# Altium schematic sheet Sheet5.SchDoc
size A3; SheetNumber: 1; SheetTotal: 1
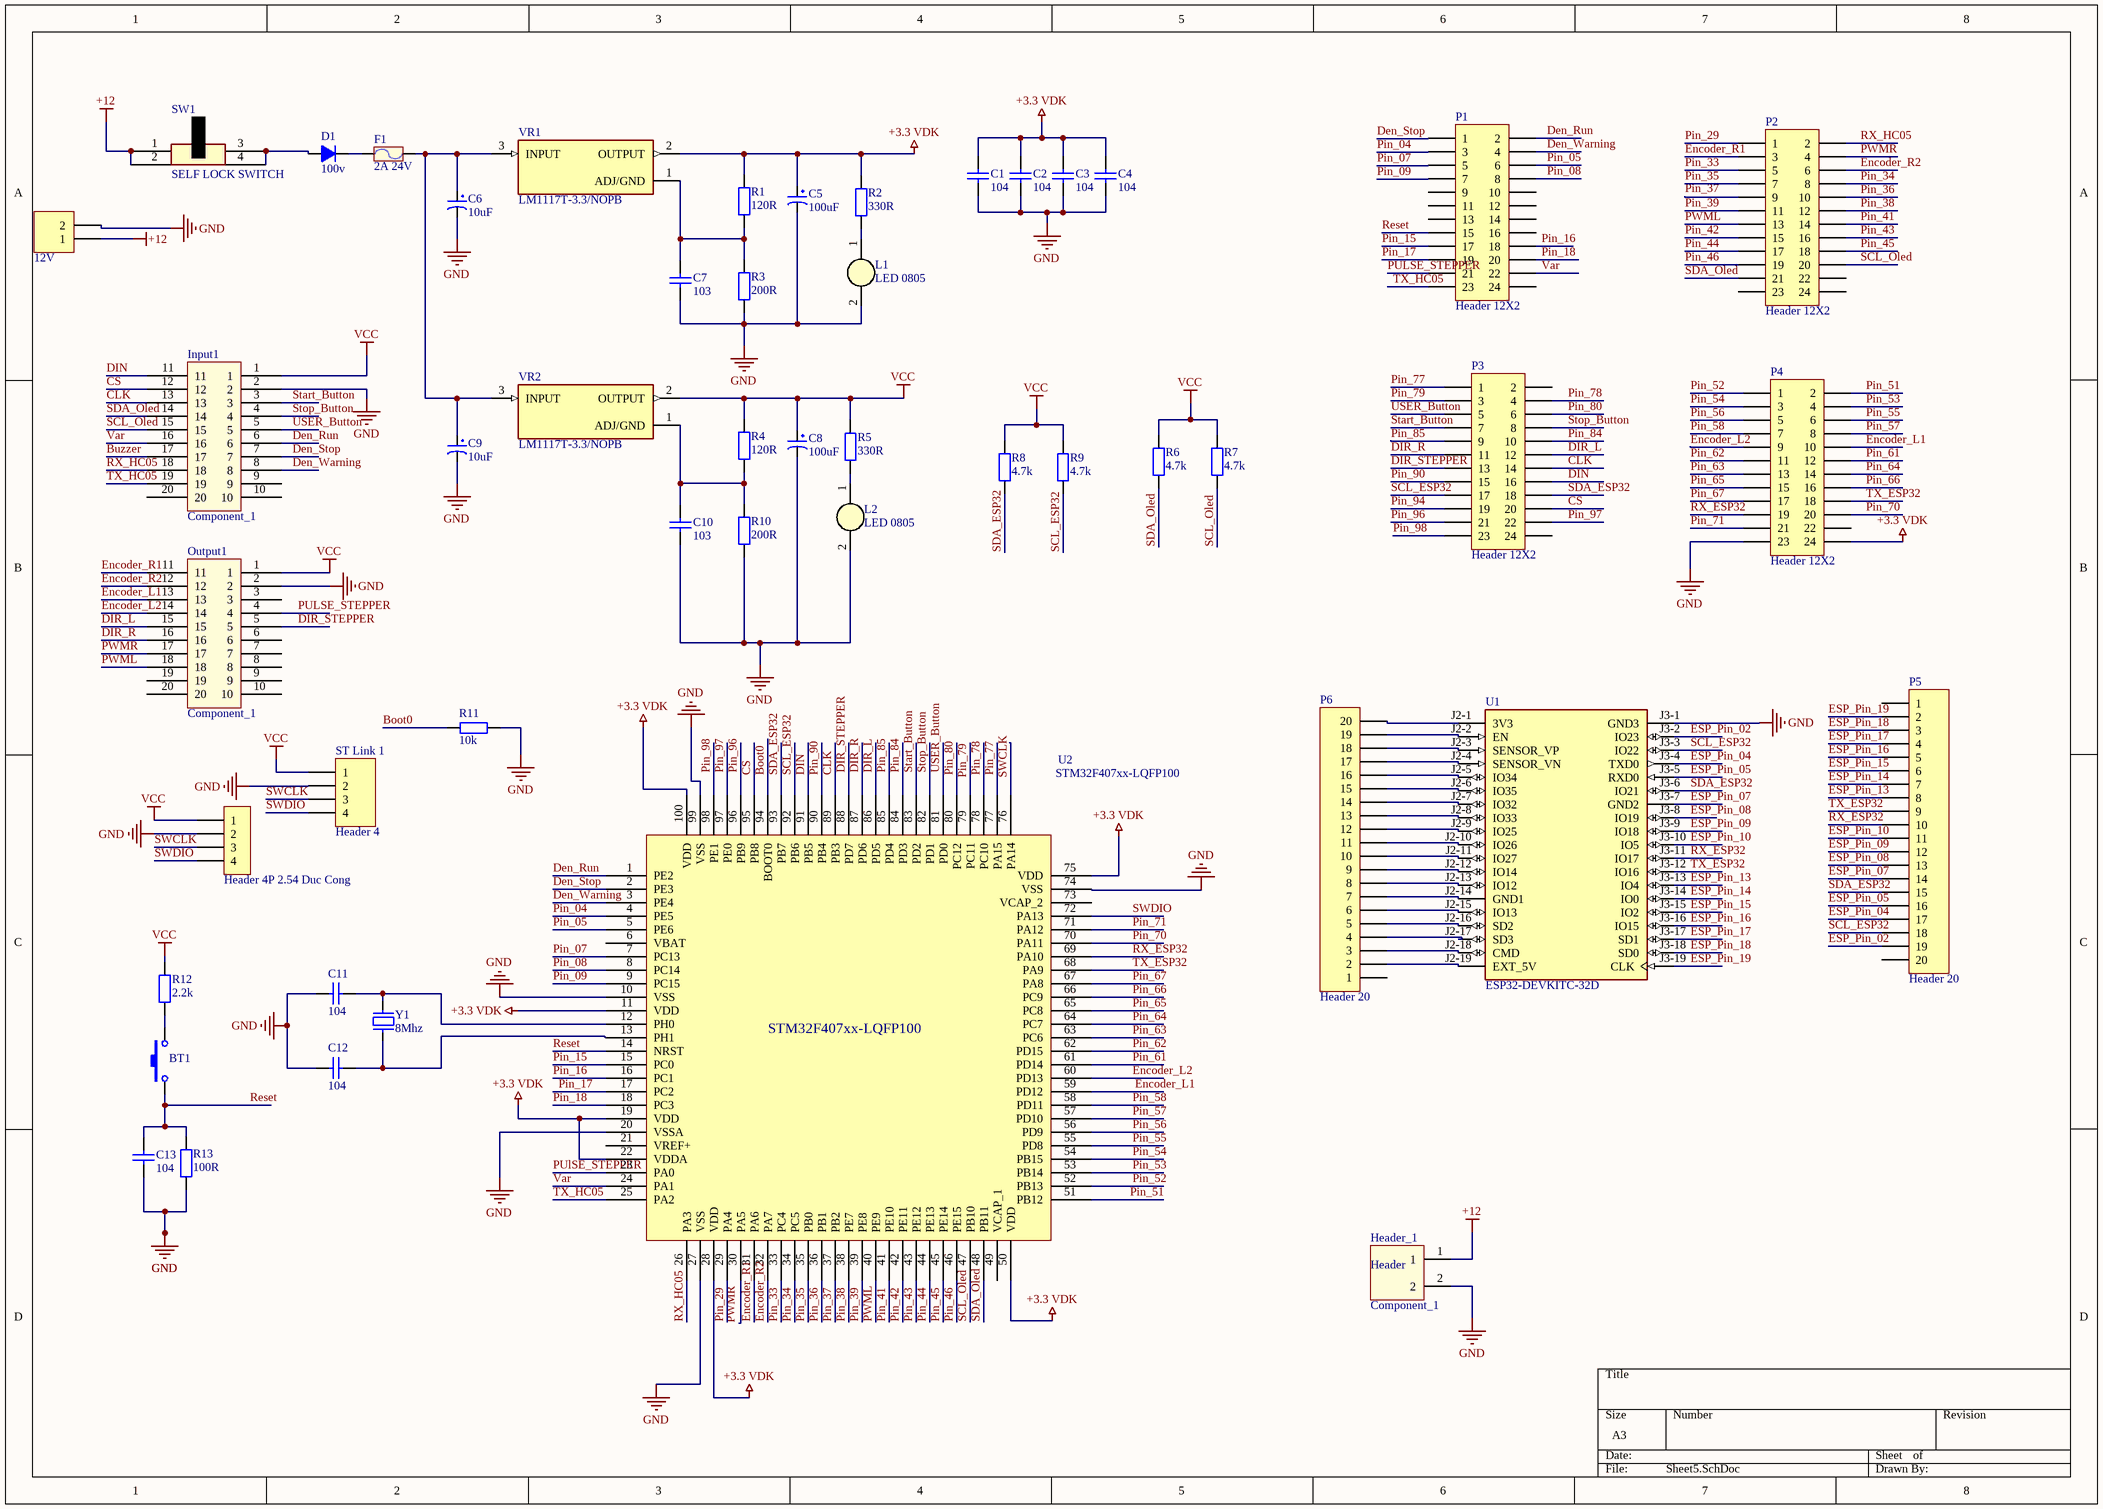
[diagram p0: Sheet5.SchDoc]

## Parts
12V  Header 2_1  [HED2]  (value not drawn)
BT1  Nut Nhan 2 Chan SMD 3x6x2.5  [Nut Nhan 2 Chan SMD 3x6x2.5]  (value not drawn)
C1  104  [tu 0805]
C2  104  [tu 0805]
C3  104  [tu 0805]
C4  104  [tu 0805]
C5  100uF  [tu hoa 5mm]
C6  10uF  [tu hoa 4mm]
C7  103  [tu 1206]
C8  100uF  [tu hoa 5mm]
C9  10uF  [tu hoa 4mm]
C10  103  [tu 1206]
C11  104  [tu 0805]
C12  104  [tu 0805]
C13  104  [tu 0805]
D1  100v  [DIODE 1A]
F1  2A 24V  [Cau chi tu phuc hoi 2A 24V SMD1812]
Header_1  Component_1  [CONN-TH_2P-P9.50_HB9500-9.5-2P]
Input1  Component_1  [PCBComponent_1]
L1  LED 0805  [LED-0805-Yellow]
L2  LED 0805  [LED-0805-Yellow]
Output1  Component_1  [PCBComponent_1]
P1  Header 12X2  [HDR2X12]
P2  Header 12X2  [HDR2X12]
P3  Header 12X2  [HDR2X12]
P4  Header 12X2  [HDR2X12]
P5  Header 20  [HDR1X20]
P6  Header 20  [HDR1X20]
R1  120R  [tro smd 0805]
R2  330R  [Tro SMD 0805]
R3  200R  [tro smd 0805]
R4  120R  [tro smd 0805]
R5  330R  [Tro SMD 0805]
R6  4.7k  [tro smd 0805]
R7  4.7k  [tro smd 0805]
R8  4.7k  [tro smd 0805]
R9  4.7k  [tro smd 0805]
R10  200R  [tro smd 0805]
R11  10k  [tro smd 0805]
R12  2.2k  [tro smd 0805]
R13  100R  [tro smd 0805]
ST_Link_1  Header 4  [HDR1X4]
ST_Link_2  Header 4P 2.54 Duc Cong  [Header 4P DC 2.54]
SW1  SELF LOCK SWITCH  [SW_70_31.5D47_TH_ST]
U1  ESP32-DEVKITC-32D  [MODULE_ESP32-DEVKITC-32D]
U2  STM32F407xx-LQFP100  [STM32_LQFP100]
VR1  LM1117T-3.3/NOPB  [TO254P1054X470X1955-3]
VR2  LM1117T-3.3/NOPB  [TO254P1054X470X1955-3]
Y1  8Mhz  [Thach Anh 2 chan SMD]

## Nets
+3.3 VDK: C1.1 C2.1 C3.1 C4.1 C5.1 P4.24 R1.2 R2.2 U2.11(VDD) U2.19(VDD) U2.22(VDDA) U2.28(VDD) U2.50(VDD) U2.75(VDD) U2.100(VDD) VR1.2(OUTPUT)
+12: 12V.1 Header_1.1 SW1.1 SW1.2
GND: 12V.2 C1.2 C2.2 C3.2 C4.2 C5.2 C6.2 C7.2 C8.2 C9.2 C10.2 C11.2 C12.2 C13.2 Header_1.2 Input1.2 L1.2(K) L2.2(K) Output1.2 P4.23 R3.1 R10.1 R11.2 R13.1 ST_Link_1.2 ST_Link_2.2 U1.J3-1(GND3) U2.10(VSS) U2.20(VSSA) U2.27(VSS) U2.74(VSS) U2.99(VSS)
VCC: C8.1 Input1.1 Output1.1 R4.2 R5.2 R6.2 R7.2 R8.2 R9.2 R12.2 ST_Link_1.1 ST_Link_2.1 VR2.2(OUTPUT)
Boot0: R11.1 U2.94(BOOT0)
Buzzer: Input1.17
CLK: Input1.13 P3.14 U2.89(PB3)
CS: Input1.12 P3.20 U2.95(PB8)
Den_Run: Input1.6 P1.2 U2.1(PE2)
Den_Stop: Input1.7 P1.1 U2.2(PE3)
Den_Warning: Input1.8 P1.4 U2.3(PE4)
DIN: Input1.11 P3.16 U2.91(PB5)
DIR_L: Output1.15 P3.12 U2.86(PD5)
DIR_R: Output1.16 P3.11 U2.87(PD6)
DIR_STEPPER: Output1.5 P3.13 U2.88(PD7)
Encoder_L1: Output1.13 P4.10 U2.59(PD12)
Encoder_L2: Output1.14 P4.9 U2.60(PD13)
Encoder_R1: Output1.11 P2.3 U2.31(PA6)
Encoder_R2: Output1.12 P2.6 U2.32(PA7)
ESP_Pin_02: P5.19 U1.J3-2(IO23)
ESP_Pin_04: P5.17 U1.J3-4(TXD0)
ESP_Pin_05: P5.16 U1.J3-5(RXD0)
ESP_Pin_07: P5.14 U1.J3-7(GND2)
ESP_Pin_08: P5.13 U1.J3-8(IO19)
ESP_Pin_09: P5.12 U1.J3-9(IO18)
ESP_Pin_10: P5.11 U1.J3-10(IO5)
ESP_Pin_13: P5.8 U1.J3-13(IO4)
ESP_Pin_14: P5.7 U1.J3-14(IO0)
ESP_Pin_15: P5.6 U1.J3-15(IO2)
ESP_Pin_16: P5.5 U1.J3-16(IO15)
ESP_Pin_17: P5.4 U1.J3-17(SD1)
ESP_Pin_18: P5.3 U1.J3-18(SD0)
ESP_Pin_19: P5.2 U1.J3-19(CLK)
Pin_04: P1.3 U2.4(PE5)
Pin_05: P1.6 U2.5(PE6)
Pin_07: P1.5 U2.7(PC13)
Pin_08: P1.8 U2.8(PC14)
Pin_09: P1.7 U2.9(PC15)
Pin_15: P1.17 U2.15(PC0)
Pin_16: P1.18 U2.16(PC1)
Pin_17: P1.19 U2.17(PC2)
Pin_18: P1.20 U2.18(PC3)
Pin_29: P2.1 U2.29(PA4)
Pin_33: P2.5 U2.33(PC4)
Pin_34: P2.8 U2.34(PC5)
Pin_35: P2.7 U2.35(PB0)
Pin_36: P2.10 U2.36(PB1)
Pin_37: P2.9 U2.37(PB2)
Pin_38: P2.12 U2.38(PE7)
Pin_39: P2.11 U2.39(PE8)
Pin_41: P2.14 U2.41(PE10)
Pin_42: P2.15 U2.42(PE11)
Pin_43: P2.16 U2.43(PE12)
Pin_44: P2.17 U2.44(PE13)
Pin_45: P2.18 U2.45(PE14)
Pin_46: P2.19 U2.46(PE15)
Pin_51: P4.2 U2.51(PB12)
Pin_52: P4.1 U2.52(PB13)
Pin_53: P4.4 U2.53(PB14)
Pin_54: P4.3 U2.54(PB15)
Pin_55: P4.6 U2.55(PD8)
Pin_56: P4.5 U2.56(PD9)
Pin_57: P4.8 U2.57(PD10)
Pin_58: P4.7 U2.58(PD11)
Pin_61: P4.12 U2.61(PD14)
Pin_62: P4.11 U2.62(PD15)
Pin_63: P4.13 U2.63(PC6)
Pin_64: P4.14 U2.64(PC7)
Pin_65: P4.15 U2.65(PC8)
Pin_66: P4.16 U2.66(PC9)
Pin_67: P4.17 U2.67(PA8)
Pin_70: P4.20 U2.70(PA11)
Pin_71: P4.21 U2.71(PA12)
Pin_77: P3.1 U2.77(PA15)
Pin_78: P3.4 U2.78(PC10)
Pin_79: P3.3 U2.79(PC11)
Pin_80: P3.6 U2.80(PC12)
Pin_84: P3.10 U2.84(PD3)
Pin_85: P3.9 U2.85(PD4)
Pin_90: P3.15 U2.90(PB4)
Pin_94: P3.19
Pin_96: P3.21 U2.96(PB9)
Pin_97: P3.22 U2.97(PE0)
Pin_98: P3.23 U2.98(PE1)
PUlSE_STEPPER: Output1.4 P1.21 U2.23(PA0)
PWML: Output1.18 P2.13 U2.40(PE9)
PWMR: Output1.17 P2.4 U2.30(PA5)
Reset: BT1.1 C13.1 P1.15 R13.2 U2.14(NRST)
RX_ESP32: P4.19 P5.10 U1.J3-11(IO17) U2.69(PA10)
RX_HC05: Input1.18 P2.2 U2.26(PA3)
SCL_ESP32: P3.17 P5.18 R9.1 U1.J3-3(IO22) U2.92(PB6)
SCL_Oled: Input1.15 P2.20 R7.1 U2.47(PB10)
SDA_ESP32: P3.18 P5.15 R8.1 U1.J3-6(IO21) U2.93(PB7)
SDA_Oled: Input1.14 P2.21 R6.1 U2.48(PB11)
Start_Button: Input1.3 P3.7 U2.83(PD2)
Stop_Button: Input1.4 P3.8 U2.82(PD1)
SWCLK: ST_Link_1.3 ST_Link_2.3 U2.76(PA14)
SWDIO: ST_Link_1.4 ST_Link_2.4 U2.72(PA13)
TX_ESP32: P4.18 P5.9 U1.J3-12(IO16) U2.68(PA9)
TX_HC05: Input1.19 P1.23 U2.25(PA2)
USER_Button: Input1.5 P3.5 U2.81(PD0)
Var: Input1.16 P1.22 U2.24(PA1)
NetBT1_2: BT1.2 R12.1
NetC6_1: C6.1 C9.1 F1.2 VR1.3(INPUT) VR2.3(INPUT)
NetC7_1: C7.1 R1.1 R3.2 VR1.1(ADJ/GND)
NetC10_1: C10.1 R4.1 R10.2 VR2.1(ADJ/GND)
NetC11_1: C11.1 U2.12(PH0) Y1.2
NetC12_1: C12.1 U2.13(PH1) Y1.1
NetD1_1: D1.1(A) SW1.3 SW1.4
NetD1_2: D1.2(K) F1.1
NetL1_1: L1.1(A) R2.1
NetL2_1: L2.1(A) R5.1
NetP6_2: P6.2 U1.J2-19(EXT_5V)
NetP6_3: P6.3 U1.J2-18(CMD)
NetP6_4: P6.4 U1.J2-17(SD3)
NetP6_5: P6.5 U1.J2-16(SD2)
NetP6_6: P6.6 U1.J2-15(IO13)
NetP6_7: P6.7 U1.J2-14(GND1)
NetP6_8: P6.8 U1.J2-13(IO12)
NetP6_9: P6.9 U1.J2-12(IO14)
NetP6_10: P6.10 U1.J2-11(IO27)
NetP6_11: P6.11 U1.J2-10(IO26)
NetP6_12: P6.12 U1.J2-9(IO25)
NetP6_13: P6.13 U1.J2-8(IO33)
NetP6_14: P6.14 U1.J2-7(IO32)
NetP6_15: P6.15 U1.J2-6(IO35)
NetP6_16: P6.16 U1.J2-5(IO34)
NetP6_17: P6.17 U1.J2-4(SENSOR_VN)
NetP6_18: P6.18 U1.J2-3(SENSOR_VP)
NetP6_19: P6.19 U1.J2-2(EN)
NetP6_20: P6.20 U1.J2-1(3V3)

Not connected (* = marked no-connect by the designer): Input1 9 10 20; Output1 3 6 7 8 9 10 19 20; P1 9 10 11 12 13 14 16 24; P2 22 23 24; P3 2 24; P4 22; P5 1 20; P6 1; U2 6(VBAT) 21(VREF+) 49(VCAP_1) 73(VCAP_2)

## Notes on the sheet
- (in symbol Component_1) Header

## Library data of the parts
12V = Header 2_1: Header, 2-Pin; Manufacturer: Generic Components; Class: Connector; Value: Header 2
BT1 = Nut Nhan 2 Chan SMD 3x6x2.5: Ma_Hang: MH001036; Ten: Nút Nhấn 2 Chân 3x6x2.5MM SMD
C1-C4 C11-C13 = Tu 0805 104 50V 10%: Dán; Don_Vi: Con; So_Chan: 2; Ten_Linh_Kien: Tụ 0805 104-100nF 10% 50V; Ma_Hang: MH004551; Chung_Loai: Dán; Kieu_Chan: *
C5 C8 = Tu Hoa 100uF 16V 5x11: Cắm; Don_Vi: Con; So_Chan: 2; Ten_Linh_Kien: Tụ Hóa 100uF 16V 5x11MM; Ma_Hang: MH008417; Chung_Loai: Cắm; Kieu_Chan: *
C6 C9 = Tu Hoa 10uF 25V 4x7: Cắm; So_Chan: 2; Ten_Linh_Kien: Tụ Hóa 10uF 25V 4x7MM; Don_Vi: Con; Ma_Hang: MH001349; Chung_Loai: Cắm; Kieu_Chan: *
C7 C10 = Tu 1206 103 50V 10%: Dán; Don_Vi: Con; So_Chan: 2; Ten_Linh_Kien: Tụ 1206 103-10nF 10% 50V; Ma_Hang: MH004543; Chung_Loai: Dán; Kieu_Chan: *
D1 = Diode 1N4007: Cắm; Ten_Linh_Kien: Diode 1N4007 1A (DIP); Don_Vi: Con; Ma_Hang: MH001063; Ghi Chu: *; Kieu_Chan: *; Chung_Loai: Cắm
F1 = Cau chi tu phuc hoi 2A 24V SMD1812: 2A 24V SMD1812; Ma_Hang: MH010033; Ten: Cầu Chì Tự Phục Hồi 2A 24V SMD1812
Input1 Output1 = Component_1: DC3_20pin
L1 L2 = LED 0805 Trang: Dán; Don_Vi: Con; Ma_Hang: MH002946; Ten_Linh_Kien: LED 0805 Màu Trắng ( White); Ghi_Chu: *; Kieu_Chan: *; Chung_Loai: Dán
P1-P4 = Header 12X2: Header, 12-Pin, Dual row; LatestRevisionDate: 17-Jul-2002; LatestRevisionNote: Re-released for DXP Platform.; Publisher: Altium Limited
P5 P6 = Header 20: Header, 20-Pin; LatestRevisionDate: 17-Jul-2002; LatestRevisionNote: Re-released for DXP Platform.; Publisher: Altium Limited
R1 R4 = Tro 0805 5% 120R: Dán; Don_Vi: Con; So_Chan: 2; Ten_Linh_Kien: Trở 0805 5% 120R; Ma_Hang: MH005253; Chung_Loai: Dán; Kieu_Chan: *
R2 R5 = Tro 0805 5% 330R: Dán; Don_Vi: Con; So_Chan: 2; Ten_Linh_Kien: Trở 0805 5% 330R; Ma_Hang: MH005337; Chung_Loai: Dán; Kieu_Chan: *
R3 R10 = Tro 0805 5% 200R: Dán; Don_Vi: Con; So_Chan: 2; Ten_Linh_Kien: Trở 0805 5% 200R; Ma_Hang: MH005257; Chung_Loai: Dán; Kieu_Chan: *
R6-R9 = Tro 0805 5% 4.7k: Dán; Don_Vi: Con; So_Chan: 2; Ten_Linh_Kien: Trở 0805 5% 4.7k; Ma_Hang: MH005307; Chung_Loai: Dán; Kieu_Chan: *
R11 = Tro 0805 5% 10k: Dán; Don_Vi: Con; So_Chan: 2; Ten_Linh_Kien: Trở 0805 5% 10k; Ma_Hang: MH005239; Chung_Loai: Dán; Kieu_Chan: *
R12 = Tro 0805 5% 2.2k: Dán; Don_Vi: Con; So_Chan: 2; Ten_Linh_Kien: Trở 0805 5% 2.2k; Ma_Hang: MH005237; Chung_Loai: Dán; Kieu_Chan: *
R13 = Tro 0805 5% 100R: Dán; Don_Vi: Con; So_Chan: 2; Ten_Linh_Kien: Trở 0805 5% 100R; Ma_Hang: MH005251; Chung_Loai: Dán; Kieu_Chan: *
ST_Link_1 = Header 4: Header, 4-Pin; LatestRevisionDate: 17-Jul-2002; LatestRevisionNote: Re-released for DXP Platform.; Publisher: Altium Limited
ST_Link_2 = Header 4P 2.54 Duc Cong: Cắm; Ten_Linh_Kien: Header 4P XH2.54-4P Đực Cong; Don_Vi: Con; Ma_Hang: MH001310; Chung_Loai: Cắm
SW1 = SW1_LOCAL-TH: 6 Pin DPDT Mini Push Button Self-locking Switch Multimeter Switch; Manufacturer Part Number: NA; Case/Package: TH; Manufacturer: NA; Supplier-1: SP ROAD; Supplier Part Number-1: NA; Alternate Part Number-1: NA
U1 = ESP32-DEVKITC-32D: WiFi Development Tools (802.11) ESP32 General Development Kit, ESP32-WROOM-32D on the board; MF: Espressif Systems; SnapEDA_Link: https://www.snapeda.com/parts/ESP32-DEVKITC-32D/Espressif+Systems/view-part/?ref=snap; Package: None; Value: *; MP: ESP32-DEVKITC-32D; Check_prices: https://www.snapeda.com/parts/ESP32-DEVKITC-32D/Espressif+Systems/view-part/?ref=eda
VR1 VR2 = LM1117T-3.3/NOPB: 800-mA 15-V linear voltage regulator; MF: Texas Instruments; Package: TO-220-3 Texas Instruments; Price: None; Check_prices: https://www.snapeda.com/parts/LM1117T-3.3/NOPB/Texas+Instruments/view-part/?ref=eda; Value: *; SnapEDA_Link: https://www.snapeda.com/parts/LM1117T-3.3/NOPB/Texas+Instruments/view-part/?ref=snap; MP: LM1117T-3.3/NOPB; Availability: In Stock; Purchase-URL: https://pricing.snapeda.com/search/part/LM1117T-3.3/NOPB/?ref=eda
Y1 = Thach Anh 2 chan SMD: Crystal For all Crystal 2pin.; Value: 4Mhz